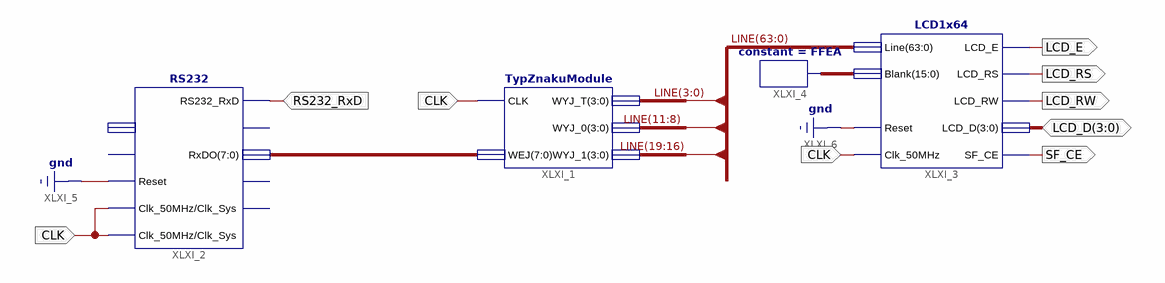
[diagram p0: schematic sheet 1]
// Xilinx ISE schematic TypZnakuScheme.sch (spartan3e) as structural Verilog: 4 symbols, 7 ports
module TypZnakuScheme (
  input  CLK,
  input  RS232_RxD,
  inout  [3:0] LCD_D,
  output LCD_E,
  output LCD_RS,
  output LCD_RW,
  output SF_CE
);

  wire [7:0] XLXN_1;
  wire [15:0] XLXN_5;
  wire [63:0] LINE;

  TypZnakuModule XLXI_1 (.CLK(CLK), .WEJ(XLXN_1), .WYJ_T(LINE[3:0]), .WYJ_0(LINE[11:8]), .WYJ_1(LINE[19:16]));
  RS232 XLXI_2 (
    .Clk_50MHz(CLK), .Reset(1'b0), .RS232_RxD(RS232_RxD), .RxDO(XLXN_1), .Clk_Sys(CLK));  // open: TxStart, TxDI, TxBusy, RxRdy, RS232_TxD
  LCD1x64 XLXI_3 (
    .Clk_50MHz(CLK), .Reset(1'b0), .Line(LINE), .Blank(XLXN_5), .LCD_D(LCD_D), .LCD_E(LCD_E),
    .LCD_RW(LCD_RW), .LCD_RS(LCD_RS), .SF_CE(SF_CE));
  constant #(.CValue("FFEA")) XLXI_4 (.O(XLXN_5));
endmodule
